# EAGLE design LissajousRevB (EAGLE 6.6.0)
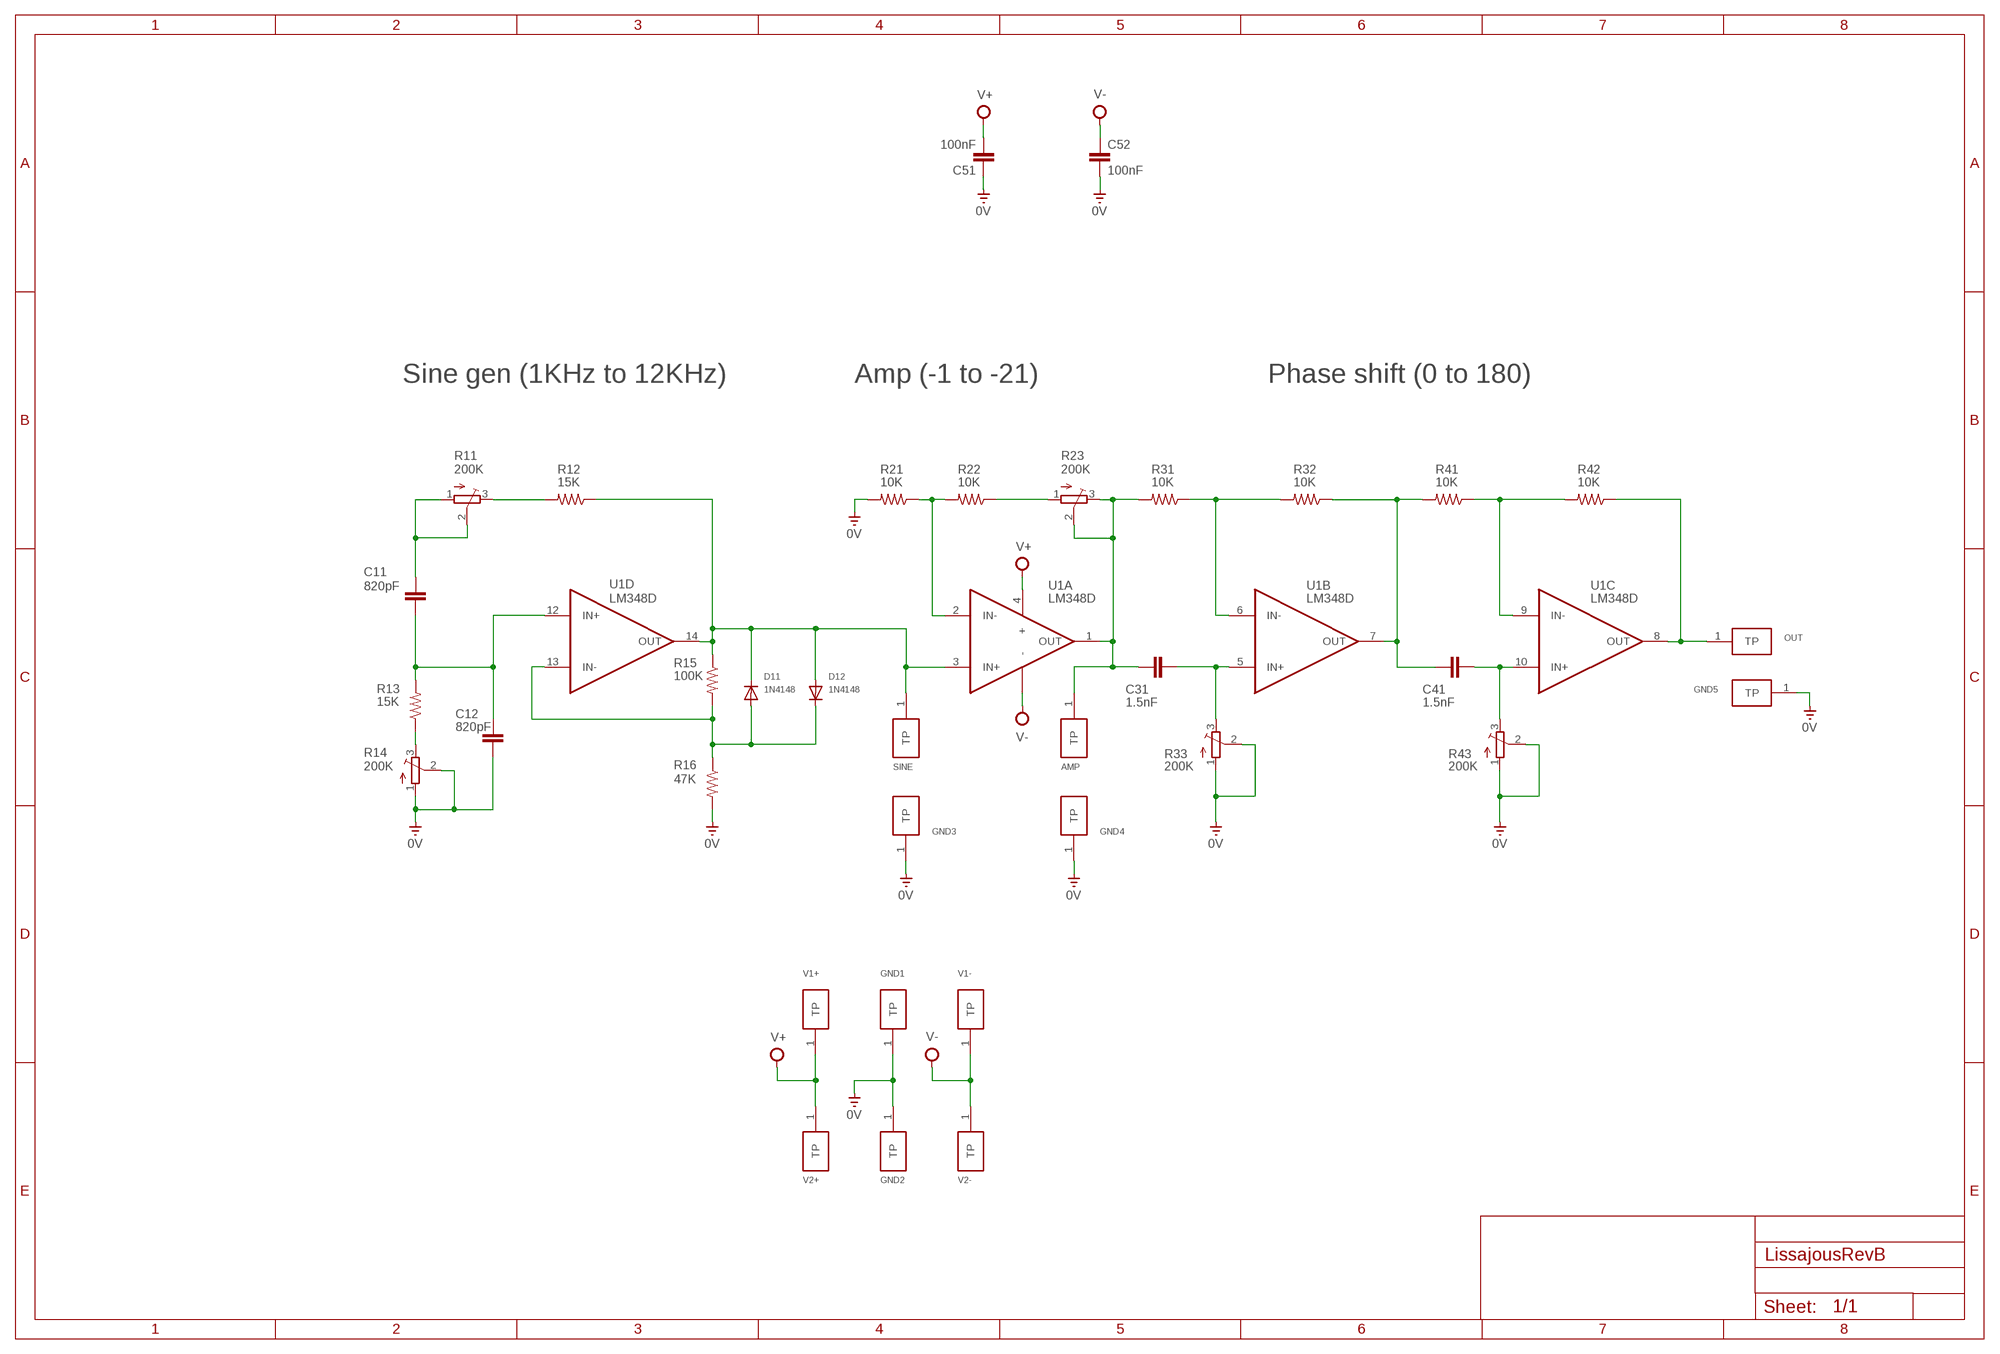
[diagram p0: schematic, sheet 1]

## Parts
AMP  TESTPADS  [TEST]
C11  820pF  CAP0603-CAP  [0603-CAP]
C12  820pF  CAP0603-CAP  [0603-CAP]
C31  1.5nF  CAP0603-CAP  [0603-CAP]
C41  1.5nF  CAP0603-CAP  [0603-CAP]
C51  100nF  CAP0603-CAP  [0603-CAP]
C52  100nF  CAP0603-CAP  [0603-CAP]
D11  1N4148  DIODESMA  [SMADIODE]
D12  1N4148  DIODESMA  [SMADIODE]
GND1  TESTPADS  [TEST]
GND2  TESTPADS  [TEST]
GND3  TESTPADS  [TEST]
GND4  TESTPADS  [TEST]
GND5  TESTPADS  [TEST]
OUT  TESTPADS  [TEST]
R11  200K  TRIMPOTTC33X  [TC33X]
R12  15K  RESISTOR0603-RES  [0603-RES]
R13  15K  RESISTOR0603-RES  [0603-RES]
R14  200K  TRIMPOTTC33X  [TC33X]
R15  100K  RESISTOR0603-RES  [0603-RES]
R16  47K  RESISTOR0603-RES  [0603-RES]
R21  10K  RESISTOR0603-RES  [0603-RES]
R22  10K  RESISTOR0603-RES  [0603-RES]
R23  200K  TRIMPOTTC33X  [TC33X]
R31  10K  RESISTOR0603-RES  [0603-RES]
R32  10K  RESISTOR0603-RES  [0603-RES]
R33  200K  TRIMPOTTC33X  [TC33X]
R41  10K  RESISTOR0603-RES  [0603-RES]
R42  10K  RESISTOR0603-RES  [0603-RES]
R43  200K  TRIMPOTTC33X  [TC33X]
SINE  TESTPADS  [TEST]
U1  LM348D  [SOIC127P600X175-14N]
V1+  TESTPADS  [TEST]
V1-  TESTPADS  [TEST]
V2+  TESTPADS  [TEST]
V2-  TESTPADS  [TEST]

## Nets
0V: C12.1 C51.1 C52.2 GND1.1(TP) GND2.1(TP) GND3.1(TP) GND4.1(TP) GND5.1(TP) R14.1(A) R14.2(S) R16.2 R21.2 R33.1(A) R33.2(S) R43.1(A) R43.2(S)
N$1: R11.3(E) R12.2
N$2: R13.1 R14.3(E)
N$3: D11.A D12.C R15.2 R16.1 U1.13(D:IN-)
N$4: C11.2 R11.1(A) R11.2(S)
N$6: R22.1 R23.1(A)
N$7: C11.1 C12.2 R13.2 U1.12(D:IN+)
N$8: R21.1 R22.2 U1.2(A:IN-)
N$9: R31.1 R32.2 U1.6(B:IN-)
N$10: C31.1 R33.3(E) U1.5(B:IN+)
N$12: AMP.1(TP) C31.2 R23.2(S) R23.3(E) R31.2 U1.1(A:OUT)
N$15: R41.1 R42.2 U1.9(C:IN-)
N$17: C41.1 R43.3(E) U1.10(C:IN+)
N$18: OUT.1(TP) R42.1 U1.8(C:OUT)
N$19: C41.2 R32.1 R41.2 U1.7(B:OUT)
SINE: D11.C D12.A R12.1 R15.1 SINE.1(TP) U1.3(A:IN+) U1.14(D:OUT)
V+: C51.2 U1.4(A:+) V1+.1(TP) V2+.1(TP)
V-: C52.1 U1.11(A:-) V1-.1(TP) V2-.1(TP)

## Notes on the sheet
- Sine gen (1KHz to 12KHz) | Amp (-1 to -21) | Phase shift (0 to 180)

## Library data of the parts
AMP GND1-GND5 OUT SINE V1+ V1- V2+ V2- = TestPads:TESTPADS
C11 C12 C31 C41 C51 C52 = passives:CAP: Capacitor Standard 0603 ceramic capacitor, and 0.1" leaded capacitor.
D11 D12 = adafruit:DIODE: Diode SMADIODE - SMA Surface Mount Package 20V 1A Schottky Diode Digikey: 641-1014-6-ND DO-1N4148 - Through Hole Small Current Diode SOD-123 20V 1 A (.5mV Vf) Schottky Diode - Digikey: MBRX120TPMSCT-ND SOD-323 10V 570mA (.38mV Vf, 3ns) Schottky Diode - Digikey: ZLLS410CT-ND SOD-523 30V 30mA Schottky Diode (RB751S-40TE61) - Digikey: RB751S-40TE61CT-ND SOT23-R/W - SOT23 Package (R = Solder Paste/Reflow Ovens, W = Hand-Soldering) BAT54Film 40V 300mA - Digikey: 497-7162-1-ND
R11 R14 R23 R33 R43 = adafruit:TRIMPOT: SMT trimmer potentiometer part number TC33X http://www.ladyada.net/library/eagle
R12 R13 R15 R16 R21 R22 R31 R32 R41 R42 = passives:RESISTOR: Resistor Basic schematic elements and footprints for 0603, 1206, and PTH resistors.
U1 = LM348D:LM348D: JFET-INPUT QUAD OPERATIONAL AMPLIFIERS; MPN: LM348D; OC_FARNELL: 9589635; OC_NEWARK: 06F9414; PACKAGE: SOIC-14; SUPPLIER: Texas Instruments

## Board
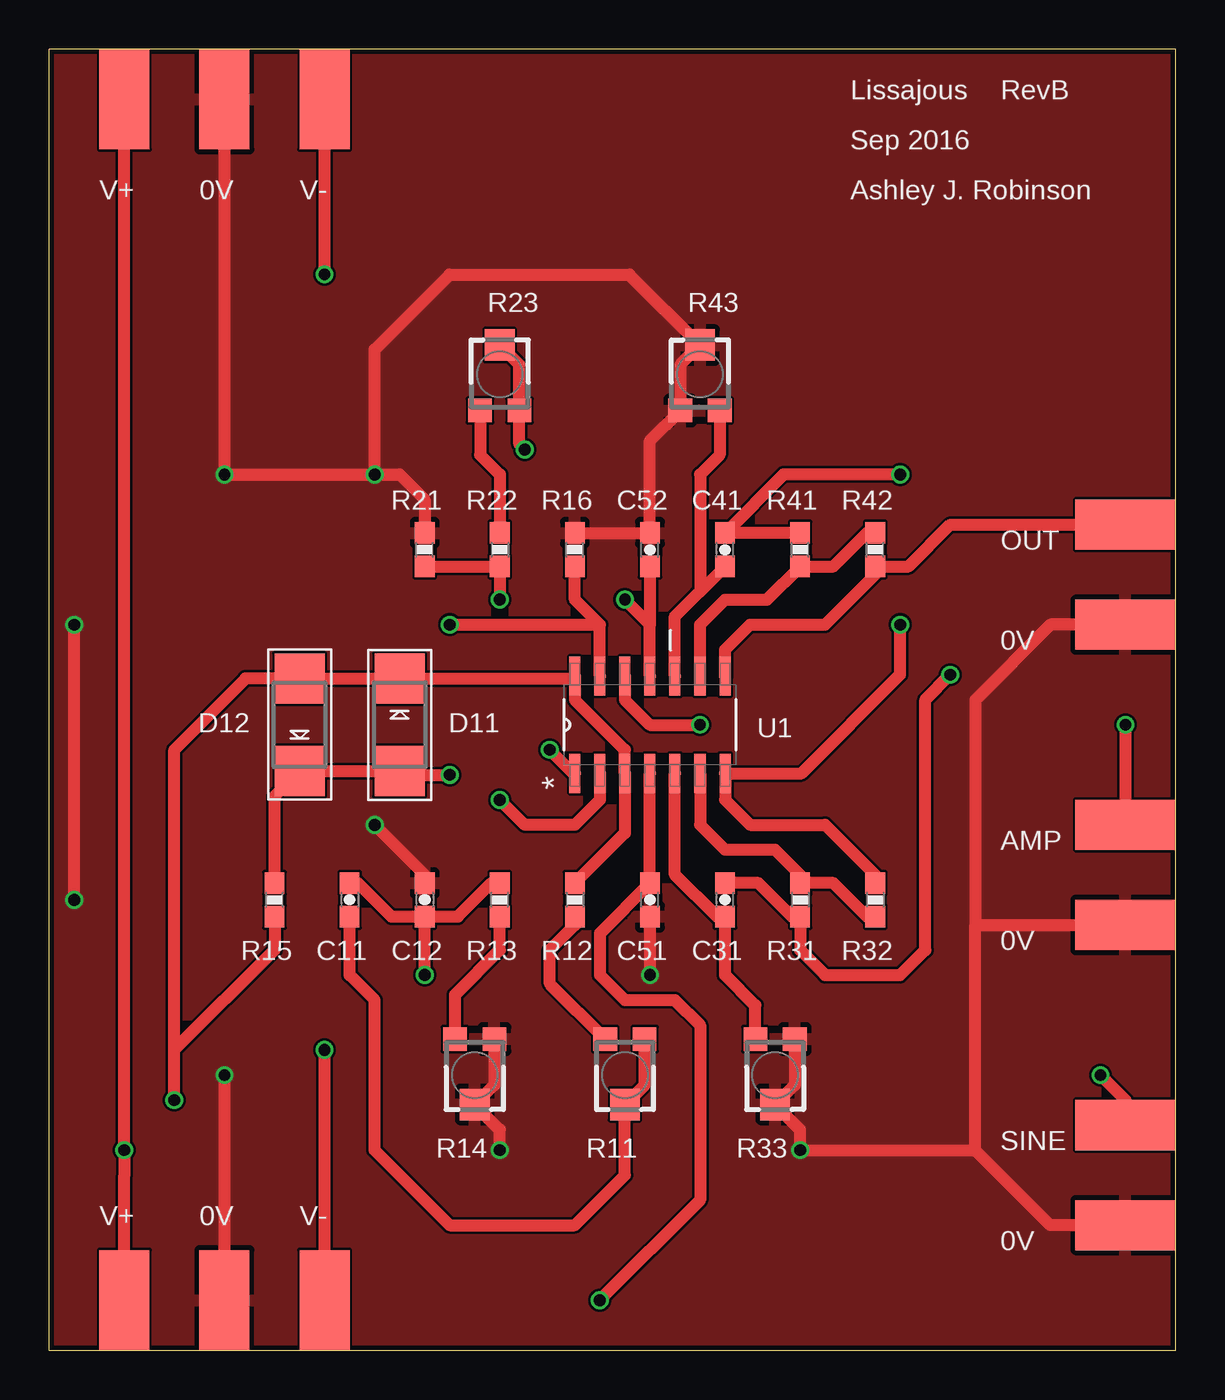
[diagram p1: board, top side]
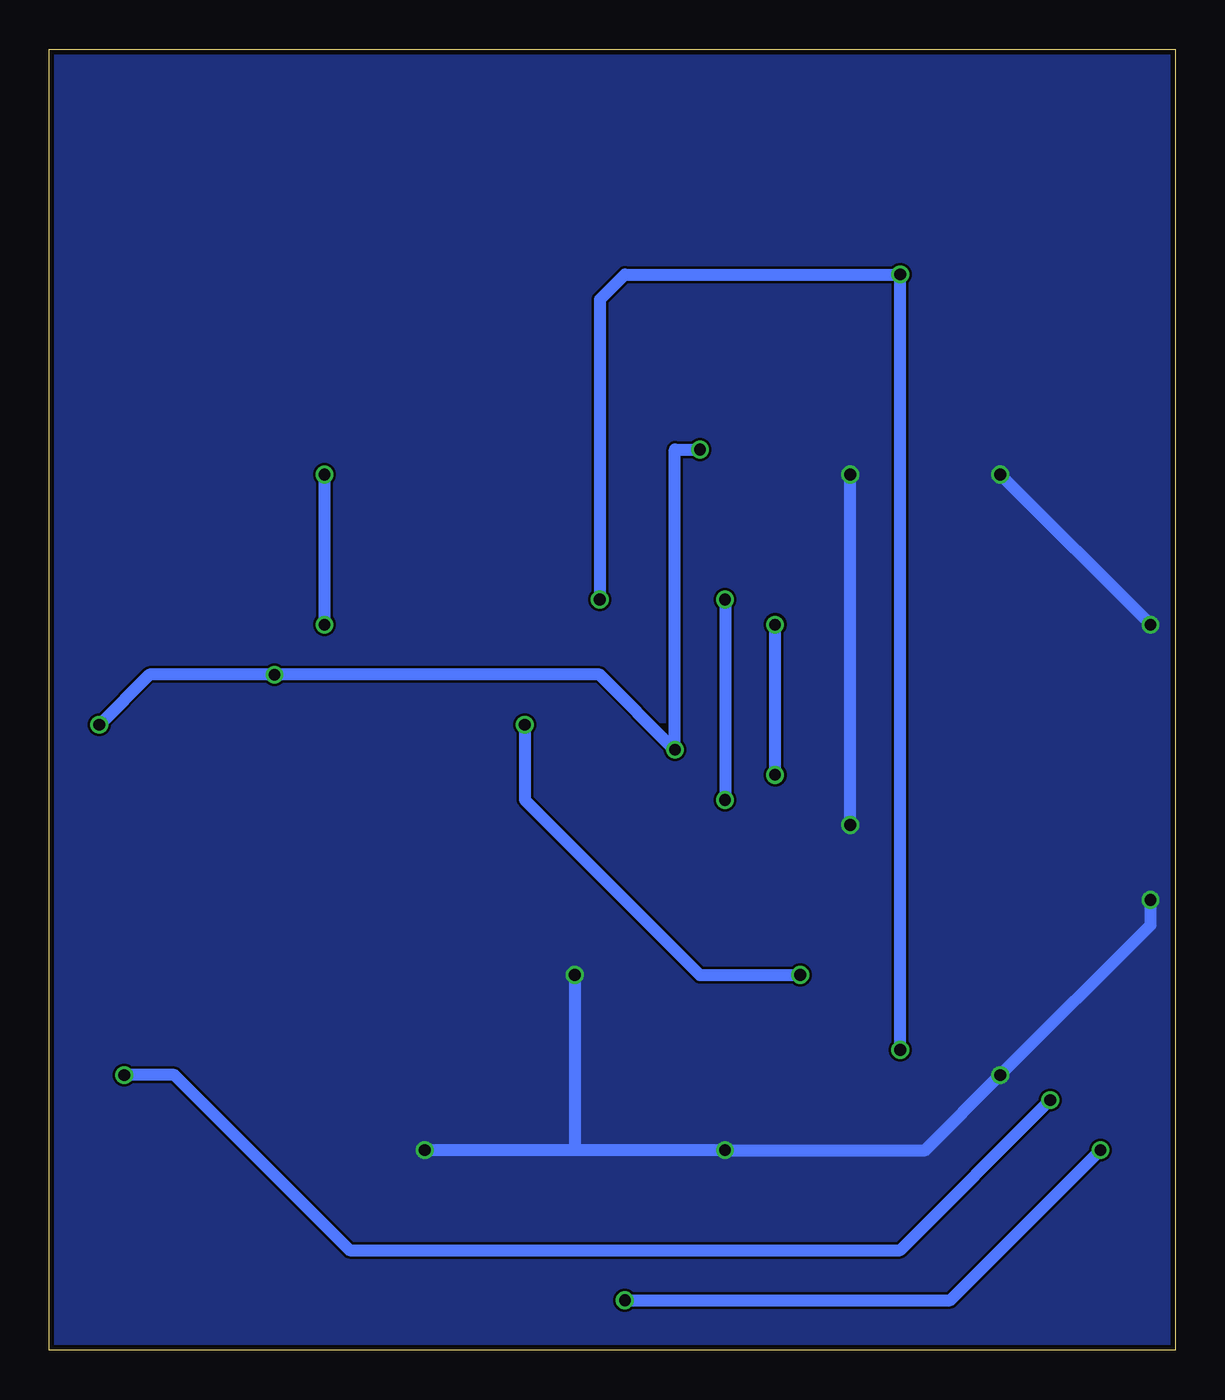
[diagram p2: board, bottom side, seen from below]

Size 57.15 x 66.04 mm. Coordinates in mm from the lower left corner, seen from the top.
Outline: 0,0 0,66.04 57.15,66.04 57.15,0 0,0
Copper layers (1*16): Top 0.035mm / dielectric 1.5mm / Bottom 0.035mm
Design rules "dirt_cheap_dirty_boards.v1": minimum track width 5mil, minimum drill 12mil, track to track 5mil, track to pad 5mil, pad to pad 5mil, via to via 5mil, smd to smd 0mil, copper to edge 10mil, drill to drill 10mil, minimum pad ring 10mil, minimum via ring 6mil, stop-mask expansion 2mil, vias tented up to drill 25mil, thermal gap 10mil

### Footprints (pad centres in the part's own frame; a part is rotated, then mirrored left to right if it is on the bottom)
TEST = smd 5.08 x 2.54: 1 0,0
0603-CAP = smd 1.1 x 1: 1 -0.85,0; 2 0.85,0
SMADIODE = smd 2.54 x 2.54: A 2.349,0; C -2.349,0
TC33X = smd 1.2 x 1.2: 1 -1,-1.825; 3 1,-1.825 | smd 1.5 x 1.6: 2 0,1.5
0603-RES = smd 1.1 x 1: 1 -0.85,0; 2 0.85,0
SOIC127P600X175-14N = smd 1.981 x 0.559: 1 -2.464,3.81; 2 -2.464,2.54; 3 -2.464,1.27; 4 -2.464,0; 5 -2.464,-1.27; 6 -2.464,-2.54; 7 -2.464,-3.81; 8 2.464,-3.81; 9 2.464,-2.54; 10 2.464,-1.27; 11 2.464,0; 12 2.464,1.27; 13 2.464,2.54; 14 2.464,3.81

### Placement (x,y rotation side)
AMP  54.61,26.67 0 top
C11  15.24,22.86 270 top
C12  19.05,22.86 270 top
C31  34.29,22.86 90 top
C41  34.29,40.64 90 top
C51  30.48,22.86 90 top
C52  30.48,40.64 90 top
D11  17.78,31.75 270 top
D12  12.7,31.75 90 top
GND1  8.89,63.5 90 top
GND2  8.89,2.54 90 top
GND3  54.61,21.59 0 top
GND4  54.61,36.83 0 top
GND5  54.61,6.35 0 top
OUT  54.61,41.91 0 top
R11  29.21,13.97 180 top
R12  26.67,22.86 270 top
R13  22.86,22.86 90 top
R14  21.59,13.97 180 top
R15  11.43,22.86 90 top
R16  26.67,40.64 90 top
R21  19.05,40.64 90 top
R22  22.86,40.64 270 top
R23  22.86,49.53 0 top
R31  38.1,22.86 270 top
R32  41.91,22.86 270 top
R33  36.83,13.97 180 top
R41  38.1,40.64 90 top
R42  41.91,40.64 90 top
R43  33.02,49.53 0 top
SINE  54.61,11.43 0 top
U1  30.48,31.75 90 top
V1+  3.81,63.5 90 top
V1-  13.97,63.5 90 top
V2+  3.81,2.54 90 top
V2-  13.97,2.54 90 top

### Tracks (layer width: path | path; a pad name or v marks a point on that pad's centre or on a via)
0V  (via drill 0.6)
  Top 0.61: C51.1 v30.48,19.05 | 46.99,21.59 GND3.1 55.88,21.59 | R33.1 37.83,13.47 R33.2 38.1,11.2 v38.1,10.16 46.99,10.16 | R14.1 22.59,13.47 R14.2 22.86,11.2 v22.86,10.16 | R16.2 C52.2 30.48,46.16 R43.1 32.02,50.03 R43.2 29.44,54.61 20.32,54.61 16.51,50.8 v16.51,44.45 | C12.1 19.05,24.13 v16.51,26.67 | R21.2 19.05,43.18 17.78,44.45 v16.51,44.45 | GND4.1 50.8,36.83 46.99,33.02 46.99,21.59 | GND5.1 50.8,6.35 46.99,10.16 | 46.99,10.16 46.99,21.59 | GND1.1 v8.89,44.45 v16.51,44.45 | v8.89,13.97 GND2.1 | v1.27,22.86 v1.27,36.83
  Bottom 0.61: v16.51,26.67 v16.51,44.45 | v30.48,19.05 30.48,10.16 | 30.48,10.16 v38.1,10.16 | 30.48,10.16 v22.86,10.16 12.7,10.16 v8.89,13.97 1.27,21.59 v1.27,22.86 | v1.27,36.83 v8.89,44.45
  pour Top: -1.27,-1.27 -1.27,67.31 58.42,67.31 58.42,-1.27
  pour Bottom: -1.27,-1.27 -1.27,67.31 58.42,67.31 58.42,-1.27
N$1
  Top 0.61: R11.3 25.4,18.61 25.4,20.32 26.67,21.59 R12.2
N$2
  Top 0.61: R14.3 20.59,18.05 22.86,20.32 R13.1
N$3  (via drill 0.6)
  Top 0.61: U1.13 27.94,36.83 | 27.94,36.83 26.67,38.1 R16.1 | v20.32,29.21 17.97,29.21 D11.A D12.C 11.43,28.13 R15.2 | v20.32,36.83 27.94,36.83
  Bottom 0.61: v20.32,29.21 v20.32,36.83
N$4
  Top 0.61: R11.1 30.21,13.47 R11.2 29.21,8.89 26.67,6.35 20.32,6.35 16.51,10.16 16.51,17.78 15.24,19.05 C11.2
N$6
  Top 0.61: R23.1 21.86,45.45 22.86,44.45 R22.1
N$7  (via drill 0.6)
  Top 0.61: C12.2 20.74,22.01 22.44,23.71 R13.2 | U1.12 29.21,33.02 30.48,31.75 v33.02,31.75 | C11.1 15.66,23.71 17.36,22.01 C12.2 | v19.05,19.05 C12.2
  Bottom 0.61: v33.02,31.75 33.02,27.94 24.13,19.05 v19.05,19.05
N$8  (via drill 0.6)
  Top 0.61: R21.1 R22.2 v22.86,38.1 | v22.86,27.94 24.13,26.67 26.67,26.67 27.94,27.94 U1.2
  Bottom 0.61: v22.86,38.1 v22.86,27.94
N$9
  Top 0.61: U1.6 33.02,26.67 34.29,25.4 36.83,25.4 38.1,24.13 R31.1 39.79,23.71 41.49,22.01 R32.2
N$10
  Top 0.61: R33.3 35.83,17.51 34.29,19.05 C31.1 33.87,22.01 31.75,24.13 U1.5
N$12  (via drill 0.6)
  Top 0.61: C31.2 35.98,23.71 37.68,22.01 R31.2 38.1,20.32 39.37,19.05 43.18,19.05 44.45,20.32 44.45,33.02 v45.72,34.29 | R23.2 23.86,50.03 R23.3 23.86,45.99 v24.13,45.72 | v54.61,31.75 AMP.1 | U1.1 26.59,29.29 v25.4,30.48
  Bottom 0.61: v54.61,31.75 52.07,34.29 v45.72,34.29 29.21,34.29 v25.4,30.48 25.4,45.72 v24.13,45.72
N$15
  Top 0.61: U1.9 33.02,36.83 34.29,38.1 36.41,38.1 R41.1 39.79,39.79 41.49,41.49 R42.2
N$17
  Top 0.61: U1.10 31.75,37.25 32.81,38.31 33.02,38.52 | 33.02,38.52 C41.1 | R43.3 34.02,45.45 33.02,44.45 33.02,38.52
N$18
  Top 0.61: U1.8 34.29,35.56 35.56,36.83 39.37,36.83 41.91,39.37 R42.1 43.6,39.79 45.72,41.91 OUT.1 55.88,41.91
N$19  (via drill 0.6)
  Top 0.61: R32.1 41.91,24.13 39.37,26.67 35.56,26.67 34.29,27.94 U1.7 38.18,29.29 43.18,34.29 v43.18,36.83 | R41.2 C41.2 37.25,44.45 v43.18,44.45
  Bottom 0.61: v43.18,36.83 v43.18,44.45
SINE  (via drill 0.6)
  Top 0.61: R12.1 29.21,26.25 U1.3 29.21,30.48 26.67,33.02 U1.14 26.56,34.1 D11.C D12.A 9.97,34.1 6.35,30.48 6.35,15.24 | v6.35,12.7 6.35,15.24 | R15.1 11.43,20.32 6.35,15.24 | v53.34,13.97 54.61,12.7 SINE.1
  Bottom 0.61: v6.35,12.7 13.97,5.08 41.91,5.08 50.8,13.97 v53.34,13.97
V+  (via drill 0.6)
  Top 0.61: U1.4 C51.2 27.94,21.17 27.94,19.05 29.21,17.78 31.75,17.78 33.02,16.51 33.02,7.62 v27.94,2.54 | 3.81,64.77 V1+.1 v3.81,10.16 3.81,8.89 V2+.1
  Bottom 0.61: v27.94,2.54 11.43,2.54 v3.81,10.16
V-  (via drill 0.6)
  Top 0.61: v13.97,54.61 V1-.1 | U1.11 30.48,36.83 | 30.48,36.83 v29.21,38.1 | C52.1 30.48,36.83 | V2-.1 v13.97,15.24
  Bottom 0.61: v13.97,15.24 v13.97,54.61 27.94,54.61 29.21,53.34 v29.21,38.1

### Text on the board
tPlace: Lissajous | RevB | Sep 2016 | V+ | 0V | V- | Ashley J. Robinson | OUT | 0V | AMP | 0V | SINE | V+ | 0V | V- | 0V
Drill_legend: Drill legend | Date: 24/09/2016 20:40 | 0.6000 mm / 23.622 mil